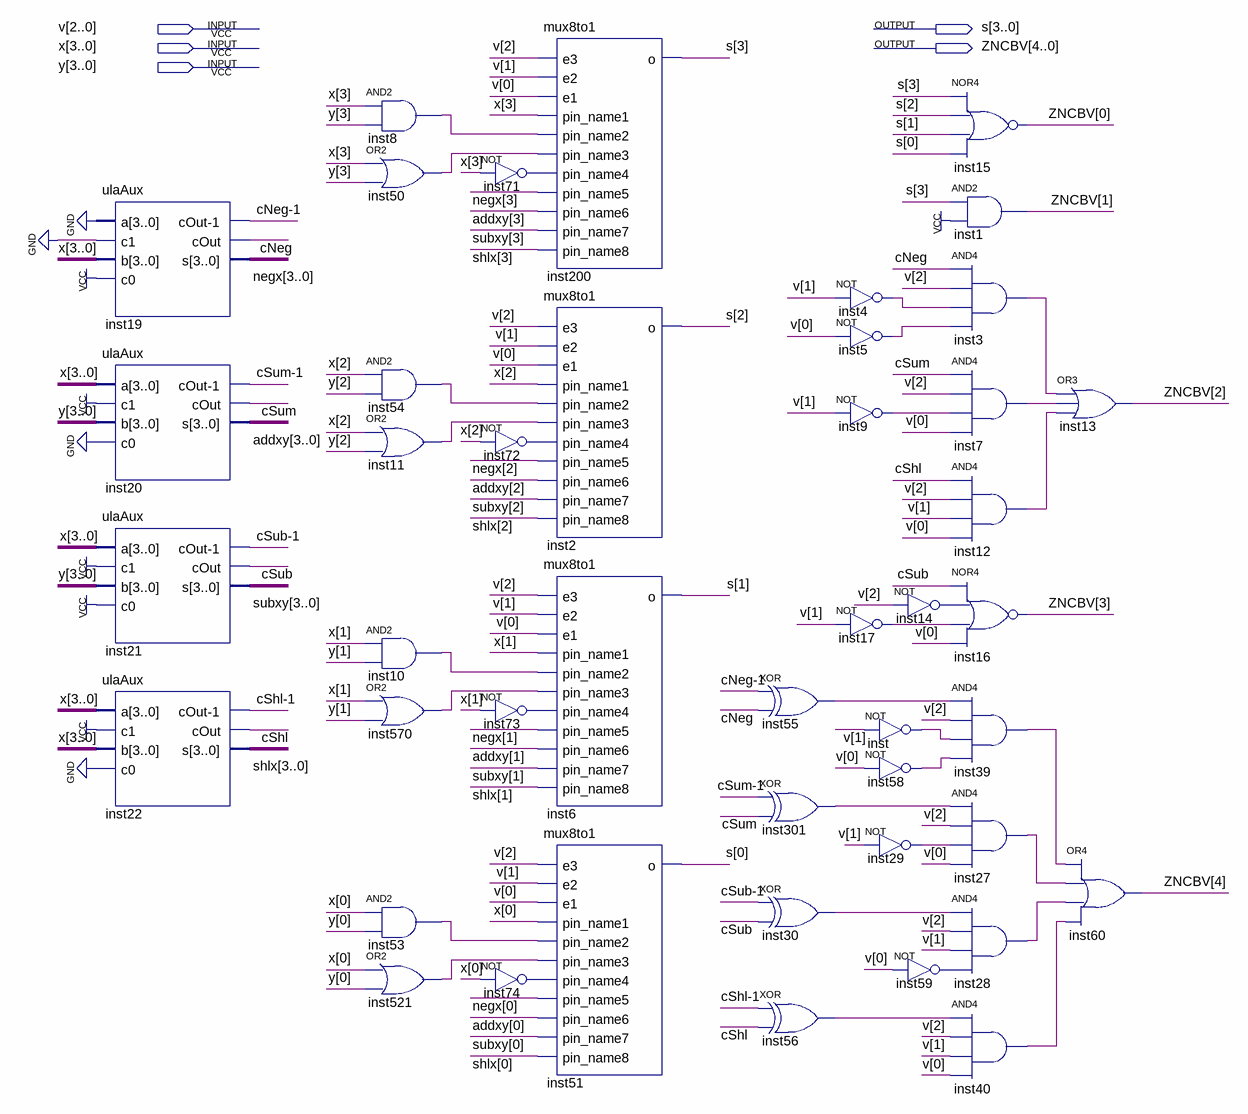
[diagram p0: schematic sheet]
// Quartus schematic ula4bits.bdf as structural Verilog: 45 symbols, 5 pins
module ula4bits (
  input  [2:0] v,
  input  [3:0] x,
  input  [3:0] y,
  output [3:0] s,
  output [4:0] ZNCBV
);

  wire cNeg, \cNeg-1 , cShl, \cShl-1 , cSub, \cSub-1 , cSum, \cSum-1 , inst3_out, inst4_out, inst5_out,
       inst7_out, inst8_out, inst9_out, inst10_out, inst11_out, inst12_out, inst14_out, inst17_out,
       inst27_out, inst28_out, inst29_out, inst30_out, inst39_out, inst40_out, inst50_out, inst53_out,
       inst54_out, inst55_out, inst56_out, inst58_out, inst59_out, inst71_out, inst72_out, inst73_out,
       inst74_out, inst301_out, inst521_out, inst570_out, inst_out;
  wire [3:0] addxy, negx, shlx, subxy;

  ulaAux inst19 (.a(4'b0000), .c1(1'b0), .b(x), .c0(1'b1), .\cOut-1 (\cNeg-1 ), .cOut(cNeg), .s(negx));
  ulaAux inst20 (.a(x), .c1(1'b1), .b(y), .c0(1'b0), .\cOut-1 (\cSum-1 ), .cOut(cSum), .s(addxy));
  ulaAux inst21 (.a(x), .c1(1'b1), .b(y), .c0(1'b1), .\cOut-1 (\cSub-1 ), .cOut(cSub), .s(subxy));
  ulaAux inst22 (.a(x), .c1(1'b1), .b(x), .c0(1'b0), .\cOut-1 (\cShl-1 ), .cOut(cShl), .s(shlx));
  and inst8 (inst8_out, x[3], y[3]);
  or inst50 (inst50_out, x[3], y[3]);
  and inst54 (inst54_out, x[2], y[2]);
  or inst11 (inst11_out, x[2], y[2]);
  and inst10 (inst10_out, x[1], y[1]);
  or inst570 (inst570_out, x[1], y[1]);
  and inst53 (inst53_out, x[0], y[0]);
  or inst521 (inst521_out, x[0], y[0]);
  not inst71 (inst71_out, x[3]);
  not inst72 (inst72_out, x[2]);
  not inst73 (inst73_out, x[1]);
  not inst74 (inst74_out, x[0]);
  mux8to1 inst200 (
    .e3(v[2]), .e2(v[1]), .e1(v[0]), .pin_name1(x[3]), .pin_name2(inst8_out), .pin_name3(inst50_out),
    .pin_name4(inst71_out), .pin_name5(negx[3]), .pin_name6(addxy[3]), .pin_name7(subxy[3]),
    .pin_name8(shlx[3]), .o(s[3]));
  mux8to1 inst2 (
    .e3(v[2]), .e2(v[1]), .e1(v[0]), .pin_name1(x[2]), .pin_name2(inst54_out), .pin_name3(inst11_out),
    .pin_name4(inst72_out), .pin_name5(negx[2]), .pin_name6(addxy[2]), .pin_name7(subxy[2]),
    .pin_name8(shlx[2]), .o(s[2]));
  mux8to1 inst6 (
    .e3(v[2]), .e2(v[1]), .e1(v[0]), .pin_name1(x[1]), .pin_name2(inst10_out), .pin_name3(inst570_out),
    .pin_name4(inst73_out), .pin_name5(negx[1]), .pin_name6(addxy[1]), .pin_name7(subxy[1]),
    .pin_name8(shlx[1]), .o(s[1]));
  mux8to1 inst51 (
    .e3(v[2]), .e2(v[1]), .e1(v[0]), .pin_name1(x[0]), .pin_name2(inst53_out), .pin_name3(inst521_out),
    .pin_name4(inst74_out), .pin_name5(negx[0]), .pin_name6(addxy[0]), .pin_name7(subxy[0]),
    .pin_name8(shlx[0]), .o(s[0]));
  xor inst55 (inst55_out, \cNeg-1 , cNeg);
  xor inst301 (inst301_out, \cSum-1 , cSum);
  xor inst30 (inst30_out, \cSub-1 , cSub);
  xor inst56 (inst56_out, \cShl-1 , cShl);
  not inst4 (inst4_out, v[1]);
  not inst5 (inst5_out, v[0]);
  not inst9 (inst9_out, v[1]);
  not inst14 (inst14_out, v[2]);
  not inst17 (inst17_out, v[1]);
  not inst (inst_out, v[1]);
  not inst58 (inst58_out, v[0]);
  not inst29 (inst29_out, v[1]);
  not inst59 (inst59_out, v[0]);
  nor inst15 (ZNCBV[0], s[3], s[2], s[1], s[0]);
  and inst1 (ZNCBV[1], s[3], 1'b1);
  and inst3 (inst3_out, cNeg, v[2], inst4_out, inst5_out);
  and inst7 (inst7_out, cSum, v[2], inst9_out, v[0]);
  and inst12 (inst12_out, cShl, v[2], v[1], v[0]);
  nor inst16 (ZNCBV[3], cSub, inst14_out, inst17_out, v[0]);
  and inst39 (inst39_out, inst55_out, v[2], inst_out, inst58_out);
  and inst27 (inst27_out, inst301_out, v[2], inst29_out, v[0]);
  and inst28 (inst28_out, inst30_out, v[2], v[1], inst59_out);
  and inst40 (inst40_out, inst56_out, v[2], v[1], v[0]);
  or inst13 (ZNCBV[2], inst3_out, inst7_out, inst12_out);
  or inst60 (ZNCBV[4], inst39_out, inst27_out, inst28_out, inst40_out);
endmodule
